# Altium schematic sheet PHY_Top.SchDoc
size A4
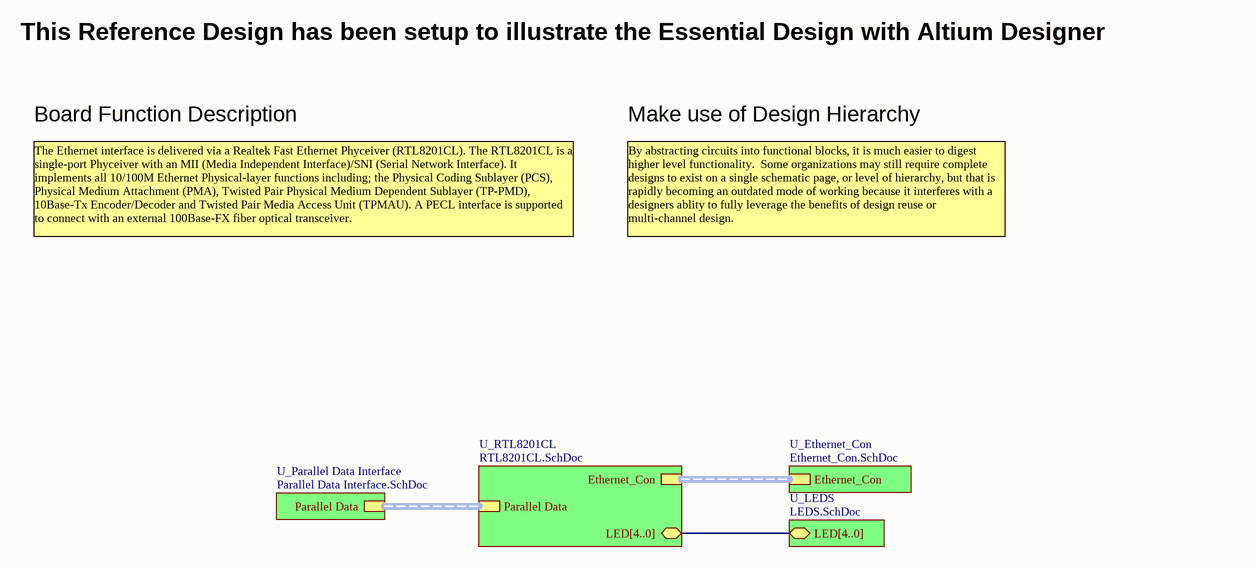
[diagram p0: PHY_Top.SchDoc]

## Sub-sheets
U_Ethernet_Con = Ethernet_Con.SchDoc: Ethernet_Con (harness Con)
U_LEDS = LEDS.SchDoc: LED[4..0] (bidir)
U_Parallel Data Interface = Parallel Data Interface.SchDoc: Parallel Data (harness Parallel Data Sets)
U_RTL8201CL = RTL8201CL.SchDoc: LED[4..0] (bidir), Ethernet_Con (harness Con), Parallel Data (harness Parallel Data Sets)

## Buses and harness runs
bus sheet U_LEDS/LED[4..0] = sheet U_RTL8201CL/LED[4..0]
harness sheet U_Ethernet_Con/Ethernet_Con = sheet U_RTL8201CL/Ethernet_Con
harness sheet U_Parallel Data Interface/Parallel Data = sheet U_RTL8201CL/Parallel Data

## Notes on the sheet
- This Reference Design has been setup to illustrate the Essential Design with Altium Designer
- Board Function Description
- Make use of Design Hierarchy
- The Ethernet interface is delivered via a Realtek Fast Ethernet Phyceiver (RTL8201CL). The RTL8201CL is a single-port Phyceiver with an MII (Media Independent Interface)/SNI (Serial Network Interface). It implements all 10/100M Ethernet Physical-layer functions including; the Physical Coding Sublayer (PCS), Physical Medium Attachment (PMA), Twisted Pair Physical Medium Dependent Sublayer (TP-PMD), 10Base-Tx Encoder/Decoder and Twisted Pair Media Access Unit (TPMAU). A PECL interface is supported to connect with an external 100Base-FX fiber optical transceiver.
- By abstracting circuits into functional blocks, it is much easier to digest higher level functionality.  Some organizations may still require complete designs to exist on a single schematic page, or level of hierarchy, but that is rapidly becoming an outdated mode of working because it interferes with a designers ablity to fully leverage the benefits of design reuse or multi-channel design.
- Title
- Size:
- Date:
- A4
- Number:
- Time:
- Revision:
- Sheet
- of
- File: